# Altium schematic sheet GPIO.SchDoc
size A4; SheetNumber: 5; SheetTotal: 7
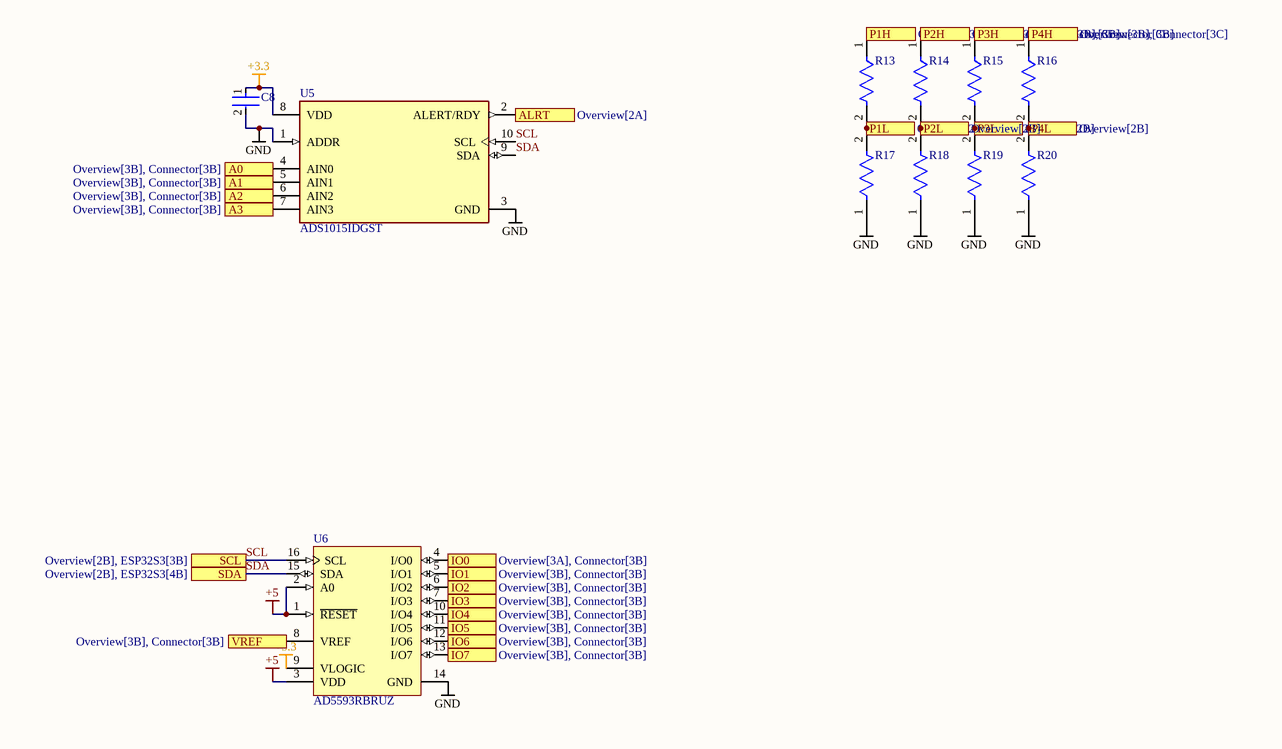
[diagram p0: GPIO.SchDoc]

## Parts
C8  GRM033R60J104KE19D  [FP-GRM033-0_03-MFG]  (value not drawn)
R13  CR1206-JW-752ELF  [FP-CR1206-IPC_B]  (value not drawn)
R14  CR1206-JW-752ELF  [FP-CR1206-IPC_B]  (value not drawn)
R15  CR1206-JW-752ELF  [FP-CR1206-IPC_B]  (value not drawn)
R16  CR1206-JW-752ELF  [FP-CR1206-IPC_B]  (value not drawn)
R17  CRCW04022K70FKED  [FP-CRCW0402-e3-IPC_A]  (value not drawn)
R18  CRCW04022K70FKED  [FP-CRCW0402-e3-IPC_A]  (value not drawn)
R19  CRCW04022K70FKED  [FP-CRCW0402-e3-IPC_A]  (value not drawn)
R20  CRCW04022K70FKED  [FP-CRCW0402-e3-IPC_A]  (value not drawn)
U5  ADS1015IDGST  [FP-DGS0010A-MFG]
U6  AD5593RBRUZ  [ADI-RU-16_L]

## Ports
A0 (see Overview[3B], Connector[3B]), A1 (see Overview[3B], Connector[3B]), A2 (see Overview[3B], Connector[3B]), A3 (see Overview[3B], Connector[3B]), ALRT (see Overview[2A]), IO0 (see Overview[3A], Connector[3B]), IO1 (see Overview[3B], Connector[3B]), IO2 (see Overview[3B], Connector[3B]), IO3 (see Overview[3B], Connector[3B]), IO4 (see Overview[3B], Connector[3B]), IO5 (see Overview[3B], Connector[3B]), IO6 (see Overview[3B], Connector[3B]), IO7 (see Overview[3B], Connector[3B]), P1H (see Overview[3B], Connector[3B]), P1L (see Overview[2B]), P2H (see Overview[3B], Connector[3B]), P2L (see Overview[2B]), P3H (see Overview[3B], Connector[3B]), P3L (see Overview[2B]), P4H (see Overview[3B], Connector[3C]), P4L (see Overview[2B]), SCL (see Overview[2B], ESP32S3[3B]), SDA (see Overview[2B], ESP32S3[4B]), VREF (see Overview[3B], Connector[3B])

## Nets
+3.3: C8.1 U5.8(VDD) U6.9(VLOGIC)
+5: U6.1(~{RESET}) U6.2(A0) U6.3(VDD)
GND: C8.2 R17.1 R18.1 R19.1 R20.1 U5.1(ADDR) U5.3(GND) U6.14(GND)
A0: U5.4(AIN0) ; port A0
A1: U5.5(AIN1) ; port A1
A2: U5.6(AIN2) ; port A2
A3: U5.7(AIN3) ; port A3
ALRT: U5.2(ALERT/RDY) ; port ALRT
IO0: U6.4(I/O0) ; port IO0
IO1: U6.5(I/O1) ; port IO1
IO2: U6.6(I/O2) ; port IO2
IO3: U6.7(I/O3) ; port IO3
IO4: U6.10(I/O4) ; port IO4
IO5: U6.11(I/O5) ; port IO5
IO6: U6.12(I/O6) ; port IO6
IO7: U6.13(I/O7) ; port IO7
P1H: R13.1 ; port P1H
P1L: R13.2 R17.2 ; port P1L
P2H: R14.1 ; port P2H
P2L: R14.2 R18.2 ; port P2L
P3H: R15.1 ; port P3H
P3L: R15.2 R19.2 ; port P3L
P4H: R16.1 ; port P4H
P4L: R16.2 R20.2 ; port P4L
SCL: U5.10(SCL) U6.16(SCL) ; port SCL
SDA: U5.9(SDA) U6.15(SDA) ; port SDA
VREF: U6.8(VREF) ; port VREF

## Library data of the parts
C8 = CMP-06035-000062-2: Chip Multilayer Ceramic Capacitors for General Purpose, 0201, 0.10uF, X5R, 15%, 10%, 6.3V; Capacitance: 100nF; Min Operating Temperature: -55°C; Lead Free: Lead Free; Radiation Hardening: No; Dielectric: X5R; Voltage Rating (DC): 6.3V; REACH SVHC: No SVHC; Case/Package: 0201; Voltage Rating: 6.3V; Length: 0.6mm; Max Operating Temperature: 85°C; Width: 0.012inch; Depth: 0.3mm; Material: Ceramic; Case Code (Metric): 0603; Thickness: 0.013inch; Packaging: Tape and Reel; Height: 0.3mm; Weight: 6E-06oz; Package Quantity: 1; Mount: Surface Mount; Voltage: 6.3V; Case Code (Imperial): 0201; Tolerance: 10%; Termination: SMD/SMT
R13-R16 = CMP-07231-003675-1: Thick Film Chip Resistors 1206 7.5kΩ 0.25W 5% 200ppm/°C; Resistance: 7.5kR; Voltage Rating: 200V; Power Rating: 250mW; Composition: Thick Film; Temperature Coefficient: 200ppm/°C; Tolerance: 5%; Depth: 1.6mm; Max Operating Temperature: 155°C; Width: 1.6mm; Min Operating Temperature: -55°C; Height: 0.6mm; Case Code (Imperial): 1206; Military Standard: Not; Case/Package: 1206; Mount: Surface Mount; Case Code (Metric): 3216; Contact Plating: Tin; Thickness: 610um; Radiation Hardening: No; Package Quantity: 5000; Termination: SMD/SMT; Packaging: Tape and Reel; Length: 3.2mm
R17-R20 = CMP-2002-08466-2: RES Thick Film, 2.7kΩ, 1%, 0.063W, 100ppm/°C, 0402; Power Rating: 63mW; Voltage Rating (DC): 50V; Resistance: 2.7kR; Termination: SMD/SMT; Composition: Thick Film; Packaging: Tape and Reel; Tolerance: 1%; Number of Pins: 2; Contact Plating: Tin; Max Operating Temperature: 155°C; Depth: 0.5mm; Features: Automotive AEC-Q200; Lead Free: Lead Free; Number of Terminations: 2; Case/Package: 0402; Max Power Dissipation: 63mW; Radiation Hardening: No; Height: 0.35mm; Min Operating Temperature: -55°C; Width: 0.02inch; Military Standard: Not; Package Quantity: 10; Weight: 2.3E-05oz; Temperature Coefficient: 100ppm/°C; Case Code (Metric): 1005; Voltage Rating: 50V; Length: 1mm; Case Code (Imperial): 0402
U5 = CMP-0003-00377-3: IC ADC 12BIT SIGMA-DELTA 10VSSOP; Supply Type: Single; Number of Converters: 1; Number of Bits: 12; Number of Inputs: 4; Sampling Rate: 3.3KS/s; Conversion Rate: 3300S/s; Min Supply Voltage: 2V; Interface: I2C; Operating Supply Voltage: 3.3V; Polarity: Bipolar; Nominal Supply Current: 150uA; Integral Nonlinearity (INL): 0.5LSB; Max Power Dissipation: 900uW; Max Supply Voltage (DC): 5.5V; Resolution: 12b; Width: 3mm; Min Operating Temperature: -40°C; Contact Plating: Gold; Number of A/D Converters: 1; Max Operating Temperature: 125°C; Height: 1.02mm; Case/Package: VSSOP; Package Quantity: 250; Number of Elements: 1; Lead Free: Lead Free; Number of Pins: 10; Radiation Hardening: No; Termination: SMD/SMT; Length: 3mm; Min Supply Voltage (DC): 2V; Power Dissipation: 900uW; Number of Channels: 4; Max Supply Voltage: 5.5V; REACH SVHC: No SVHC; Packaging: Tape and Reel
U6 = CMP-2000-05745-1: Configurable ADC/DAC with On-Chip Reference, I2C Interface, 8-Channel, 12-Bit, 1.8 to 5.5 V, -40 to 105 degC, 16-Pin TSSOP (RU), RoHS, Tube; Manufacturer: AnalogDevicesInc.; Unit Weight: 0.006102oz; Package Version: 11/2002; Settling Time: 6us; Input Voltage: 5.5V; SNR - Signal to Noise Ratio: 81dB; Architecture: Segment; Supply Voltage - Min: 2.7V; Number of Converters: 9Converter; Number of ADC Channels: 8Channel; Output Type: Digital; Brand: AnalogDevices; Interface Type: Serial,I2C,SPI; Input Type: Analog,Digital; Reference Voltage: 2.5V; Sampling Rate: 400kS/s; Shutdown: NoShutdown; Resolution: 12bit; Maximum Operating Temperature: +105C; Datasheet Version: Rev. B, 01/2016; Mounting Technology: SurfaceMount; Factory Pack Quantity: 96; Manufacturer URL: http://www.analog.com/; Mounting Style: SMD/SMT; Package / Case: TSSOP-16; Operating Supply Voltage: 5.5V; Series: AD5593R; Package Description: 16-Pin Thin Shrink Small Outline Package, Body 5 x 4.4 mm, Pitch 0.65 mm; Minimum Operating Temperature: -40C; Datasheet URL: http://www.analog.com/media/en/technical-documentation/data-sheets/AD5593R.pdf; Package Reference: RU-16; RoHS: True; Number of DAC Channels: 8Channel; Product: MultichannelADCs/DACs; Number of Channels: 8Channel; Package URL: http:/www.analog.com/static/imported-files/packages/36244347913743854010197452789RU16.pdf; Product Category: DataAcquisitionADCs/DACs-Specialized; Type: ConfigurableADC/DACwithOn-ChipReference; Packaging: Tube; Supply Voltage - Max: 5.5V